# EAGLE schematic tiny13_charlie4_50mm_2xAAA_optical_diag (EAGLE 6.2)
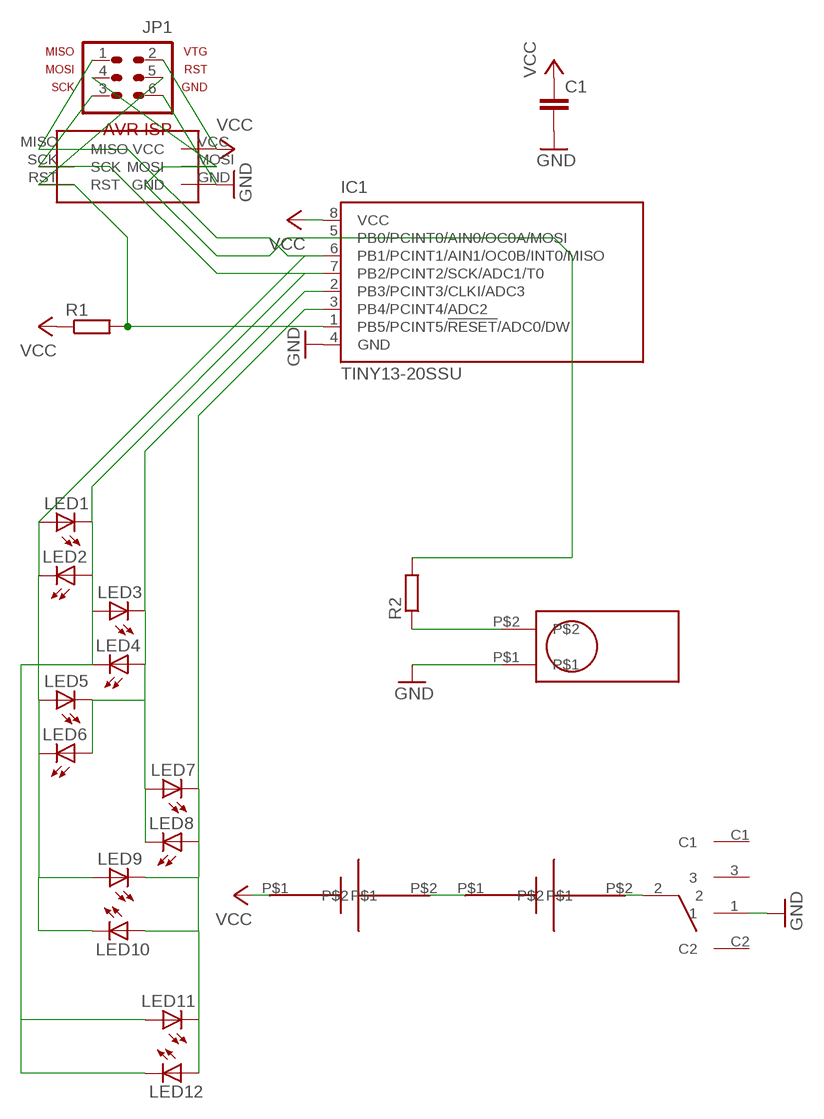
[diagram p0: schematic, sheet 1]

## Parts
C1  C-EU025-025X050  [C025-025X050]
IC1  TINY13-20SSU  [8S1]
JP1  AVR-ISP-6  [AVR-ISP-6]
LED1  LED3MM  [LED3MM]
LED2  LED3MM  [LED3MM]
LED3  LED3MM  [LED3MM]
LED4  LED3MM  [LED3MM]
LED5  LED3MM  [LED3MM]
LED6  LED3MM  [LED3MM]
LED7  LED3MM  [LED3MM]
LED8  LED3MM  [LED3MM]
LED9  LED3MM  [LED3MM]
LED10  LED3MM  [LED3MM]
LED11  LED3MM  [LED3MM]
LED12  LED3MM  [LED3MM]
R1  R-EU_0204/5  [0204/5]
R2  R-EU_0204/5  [0204/5]
U$1  TILT_SWITCH_WRAP  [TILT_SWITCH_VAR]
U$2  AVR_ISP_6_PIN_1X6_SMT_CONTACT_BIG  [CONTACT_ISP_PROGRAMMER_1X6_ATMEL]
U$3  1XAAA  [AAA_THROUGH_HOLE]
U$4  SWITCH  [SWITCH]
U$5  1XAAA  [AAA_THROUGH_HOLE]

## Nets
GND: C1.2 IC1.4(GND) JP1.6 U$1.P$1 U$2.GND U$4.1
N$1: IC1.2(PB3/PCINT3/CLKI/ADC3) LED3.K(C) LED4.A LED5.K(C) LED6.A LED7.A LED8.K(C)
N$2: IC1.7(PB2/PCINT2/SCK/ADC1/T0) JP1.3 LED1.K(C) LED2.A LED3.A LED4.K(C) LED11.A LED12.K(C) U$2.SCK
N$3: R2.1 U$1.P$2
N$4: IC1.3(PB4/PCINT4/ADC2) LED7.K(C) LED8.A LED9.K(C) LED10.A LED11.K(C) LED12.A
N$5: IC1.5(PB0/PCINT0/AIN0/OC0A/MOSI) JP1.4 R2.2 U$2.MOSI
N$6: IC1.1(PB5/PCINT5/!RESET!/ADC0/DW) JP1.5 R1.2 U$2.RST
N$7: U$3.P$2 U$5.P$1
N$8: IC1.6(PB1/PCINT1/AIN1/OC0B/INT0/MISO) JP1.1 LED1.A LED2.K(C) LED5.A LED6.K(C) LED9.A LED10.K(C) U$2.MISO
N$9: U$4.2 U$5.P$2
VCC: C1.1 IC1.8(VCC) JP1.2 R1.1 U$2.VCC U$3.P$1
Unconnected: U$4.3 U$4.C1 U$4.C2

## Library data of the parts
C1 = resistor:C-EU: CAPACITOR, European symbol
IC1 = atmel:TINY13: 8-bit AVR Microcontroller with 1K Bytes In-System Programmable Flash Source: http://www.atmel.com/dyn/resources/prod_documents/2535S.pdf; MPN: ATTINY13-20SSU; OC_FARNELL: 1455133; OC_NEWARK: 58M3771
JP1 = avr-5:AVR-ISP-6: AVR ISP-6 Serial Programming Header
LED1-LED12 = 0-svo:LED: LED OSRAM: - CHIPLED LG R971, LG N971, LY N971, LG Q971, LY Q971, LO R971, LY R971 LH N974, LH R974 LS Q976, LO Q976, LY Q976 LO Q996 - Hyper CHIPLED LW Q18S LB Q993, LB Q99A, LB R99A - SideLED LS A670, LO A670, LY A670, LG A670, LP A670 LB A673, LV A673, LT A673, LW A673 LH A674 LY A675 LS A676, LA A676, LO A676, LY A676, LW A676 LS A679, LY A679, LG A679 - Hyper Micro SIDELED® LS Y876, LA Y876, LO Y876, LY Y876 LT Y87S - SmartLED LW L88C, LW L88S LB L89C, LB L89S, LG L890 LS L89K, LO L89K, LY L89K LS L896, LA L896, LO L896, LY L896 - TOPLED LS T670, LO T670, LY T670, LG T670, LP T670 LSG T670, LSP T670, LSY T670, LOP T670, LYG T670 LG T671, LOG T671, LSG T671 LB T673, LV T673, LT T673, LW T673 LH T674 LS T676, LA T676, LO T676, LY T676, LB T676, LH T676, LSB T676, LW T676 LB T67C, LV T67C, LT T67C, LS T67K, LO T67K, LY T67K, LW E67C LS E67B, LA E67B, LO E67B, LY E67B, LB E67C, LV E67C, LT E67C LW T67C LS T679, LY T679, LG T679 LS T770, LO T770, LY T770, LG T770, LP T770 LB T773, LV T773, LT T773, LW T773 LH T774 LS E675, LA E675, LY E675, LS T675 LS T776, LA T776, LO T776, LY T776, LB T776 LHGB T686 LT T68C, LB T68C - Hyper Mini TOPLED® LB M676 - Mini TOPLED Santana® LG M470 LS M47K, LO M47K, LY M47K Source: http://www.osram.convergy.de/
R1 R2 = resistor:R-EU_: RESISTOR, European symbol
U$1 = Mrule:TILT_SWITCH_WRAP
U$2 = Mrule:AVR_ISP_6_PIN_1X6_SMT_CONTACT_BIG
U$3 U$5 = Mrule:1XAAA
U$4 = Mrule:SWITCH